# Altium schematic sheet [09] - SD CARD.SchDoc: SD CARD
size A4; Organization: Bjørn T. Brodtkorb; Address1: Frode Rinnans veg 161; Address2: 7050 Trondheim; DocumentNumber: 10; Revision: 1.0; SheetNumber: 10; SheetTotal: 13
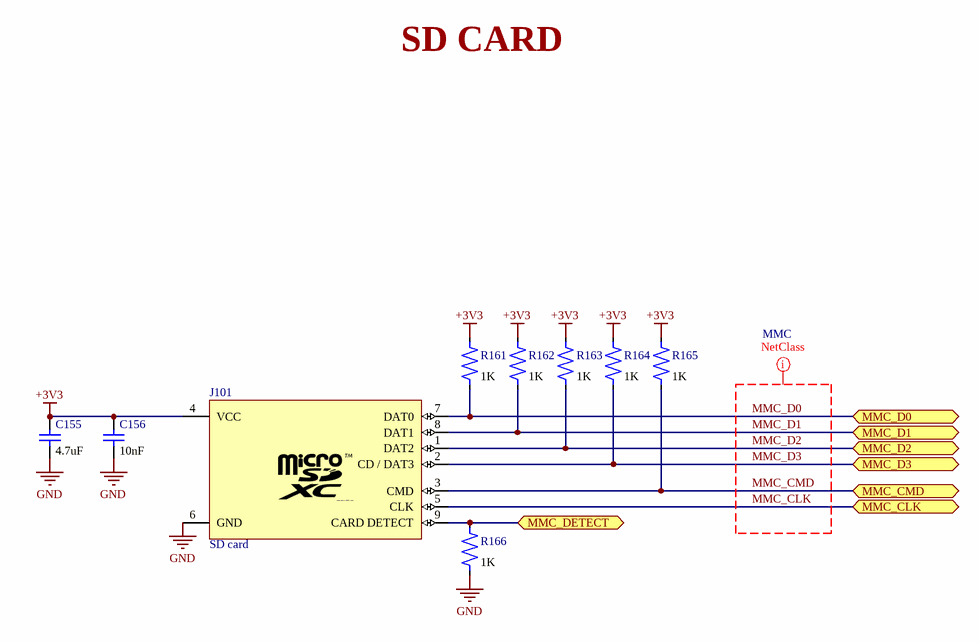
[diagram p0: [09] - SD CARD.SchDoc]

## Parts
C155  value 4.7uF  [C0603]  (hidden comment: 02016D104KAT2A)
C156  value 10nF  [C0402]  (hidden comment: 04023C103KAT2A)
J101  SD card  [SD card push push]
R161  value 1K  [R0402]  (hidden comment: CRCW04020000Z0ED)
R162  value 1K  [R0402]  (hidden comment: CRCW04020000Z0ED)
R163  value 1K  [R0402]  (hidden comment: CRCW04020000Z0ED)
R164  value 1K  [R0402]  (hidden comment: CRCW04020000Z0ED)
R165  value 1K  [R0402]  (hidden comment: CRCW04020000Z0ED)
R166  value 1K  [R0402]  (hidden comment: CRCW04020000Z0ED)

## Ports
MMC_CLK (bidir), MMC_CMD (bidir), MMC_D0 (bidir), MMC_D1 (bidir), MMC_D2 (bidir), MMC_D3 (bidir), MMC_DETECT (bidir)

## Nets
+3V3: C155.2 C156.2 J101.4(VCC) R161.2 R162.2 R163.2 R164.2 R165.2
GND: C155.1 C156.1 J101.6(GND) R166.1
MMC_CLK: J101.5(CLK) ; port MMC_CLK
MMC_CMD: J101.3(CMD) R165.1 ; port MMC_CMD
MMC_D0: J101.7(DAT0) R161.1 ; port MMC_D0
MMC_D1: J101.8(DAT1) R162.1 ; port MMC_D1
MMC_D2: J101.1(DAT2) R163.1 ; port MMC_D2
MMC_D3: J101.2(CD_/_DAT3) R164.1 ; port MMC_D3
MMC_DETECT: J101.9(CARD_DETECT) R166.2 ; port MMC_DETECT

## Layout directives
net class MMC: MMC_CLK, MMC_CMD, MMC_D0, MMC_D1, MMC_D2, MMC_D3

## Notes on the sheet
- SD CARD
- Title
- Size:
- Date:
- A4
- Number:
- Time:
- Revision:
- Sheet
- of
- StrawberryHacker
- File:

## Library data of the parts
C155 = 02016D104KAT2A: C0603
C156 = 04023C103KAT2A: C0402
J101 = 47219-2001_1: SD micro card push push; Supplier Part Number 1: 2614940; Supplier 1: Farnell
R161-R166 = CRCW04020000Z0ED: R0402